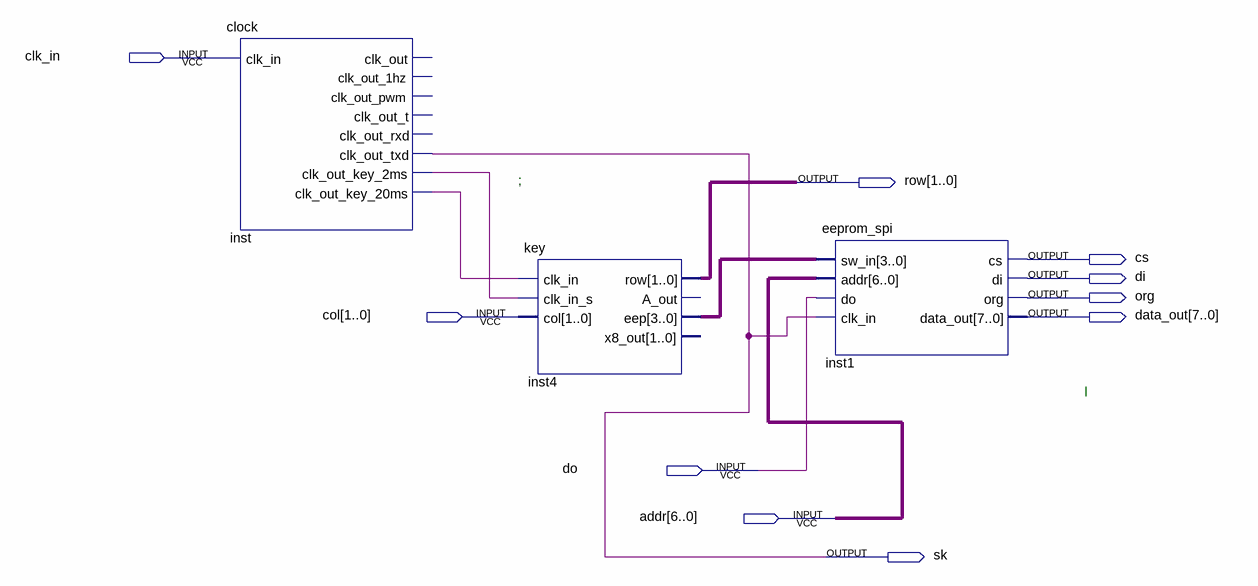
[diagram p0: schematic sheet]
// Quartus schematic eeprom_spi_bdf.bdf as structural Verilog: 3 symbols, 10 pins
module eeprom_spi_bdf (
  input  clk_in,
  input  [1:0] col,
  input  \do ,
  input  [6:0] addr,
  output [1:0] row,
  output cs,
  output di,
  output org,
  output [7:0] data_out,
  output sk
);

  wire inst_clk_out_key_2ms, inst_clk_out_key_20ms;
  wire [3:0] inst4_eep;

  clock inst (
    .clk_in(clk_in), .clk_out_txd(sk), .clk_out_key_2ms(inst_clk_out_key_2ms),
    .clk_out_key_20ms(inst_clk_out_key_20ms));  // open: clk_out, clk_out_1hz, clk_out_pwm, clk_out_t, clk_out_rxd
  key inst4 (
    .clk_in(inst_clk_out_key_20ms), .clk_in_s(inst_clk_out_key_2ms), .col(col), .row(row), .eep(inst4_eep));  // open: A_out, x8_out
  eeprom_spi inst1 (
    .sw_in(inst4_eep), .addr(addr), .\do (\do ), .clk_in(sk), .cs(cs), .di(di), .org(org), .data_out(data_out));

  // Notes on the sheet:
  //   ;
  //   l
endmodule
